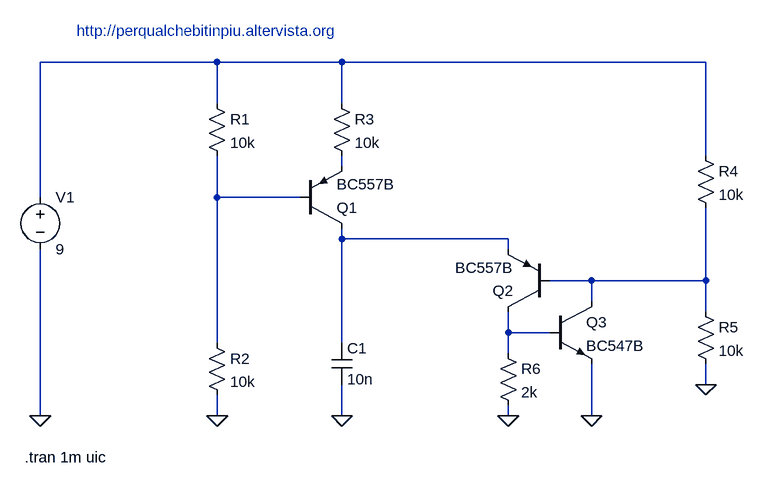
[diagram p0: schematic Generatore_dente_di_sega.asc]
Generatore_dente_di_sega.asc, the LTspice schematic file:
Version 4
SHEET 1 948 680
WIRE 0 -112 -272 -112
WIRE 192 -112 0 -112
WIRE 752 -112 192 -112
WIRE 0 -48 0 -112
WIRE 192 -48 192 -112
WIRE 752 32 752 -112
WIRE 192 48 192 32
WIRE -272 96 -272 -112
WIRE 0 96 0 32
WIRE 128 96 0 96
WIRE 192 160 192 144
WIRE 448 160 192 160
WIRE 448 176 448 160
WIRE 576 224 512 224
WIRE 752 224 752 112
WIRE 752 224 576 224
WIRE 576 256 576 224
WIRE 752 272 752 224
WIRE 448 304 448 272
WIRE 512 304 448 304
WIRE 0 320 0 96
WIRE 192 320 192 160
WIRE 448 336 448 304
WIRE 752 384 752 352
WIRE -272 432 -272 176
WIRE 0 432 0 400
WIRE 192 432 192 384
WIRE 448 432 448 416
WIRE 576 432 576 352
FLAG 192 432 0
FLAG 0 432 0
FLAG -272 432 0
FLAG 752 384 0
FLAG 576 432 0
FLAG 448 432 0
SYMBOL res -16 -64 R0
SYMATTR InstName R1
SYMATTR Value 10k
SYMBOL res -16 304 R0
SYMATTR InstName R2
SYMATTR Value 10k
SYMBOL pnp 128 144 M180
SYMATTR InstName Q1
SYMATTR Value BC557B
SYMBOL res 176 -64 R0
SYMATTR InstName R3
SYMATTR Value 10k
SYMBOL cap 176 320 R0
SYMATTR InstName C1
SYMATTR Value 10n
SYMBOL voltage -272 80 R0
WINDOW 123 0 0 Left 0
WINDOW 39 0 0 Left 0
SYMATTR InstName V1
SYMATTR Value 9
SYMBOL pnp 512 272 R180
SYMATTR InstName Q2
SYMATTR Value BC557B
SYMBOL npn 512 256 R0
SYMATTR InstName Q3
SYMATTR Value BC547B
SYMBOL res 736 16 R0
SYMATTR InstName R4
SYMATTR Value 10k
SYMBOL res 736 256 R0
SYMATTR InstName R5
SYMATTR Value 10k
SYMBOL res 432 320 R0
SYMATTR InstName R6
SYMATTR Value 2k
TEXT -296 496 Left 2 !.tran 1m uic
TEXT -216 -160 Left 2 ;http://perqualchebitinpiu.altervista.org

The netlist it stands for:
* Generatore_dente_di_sega.asc
R1 N001 N003 10k
R2 N003 0 10k
Q1 N004 N003 N002 0 BC557B
R3 N001 N002 10k
C1 N004 0 10n
V1 N001 0 9
Q2 N006 N005 N004 0 BC557B
Q3 N005 N006 0 0 BC547B
R4 N001 N005 10k
R5 N005 0 10k
R6 N006 0 2k
.model NPN NPN
.model PNP PNP
.lib standard.bjt
.tran 1m uic
* http://perqualchebitinpiu.altervista.org
.backanno
.end